# EasyEDA Pro project opendeep.dbg001.cnc.v01.eprj

# Schematic opendeep.dbg001.cnc.v01
Board Name: opendeep.dbg001.cnc.v01; Create Date: 2026-08-02; Page Name: P1; Project Name: opendeep.dbg001.cnc.v01; Schematic Name: opendeep.dbg001.cnc.v01; Update Date: 2026-08-02; Company: EasyEDA.com; Page Size: A4; Version: V1.0
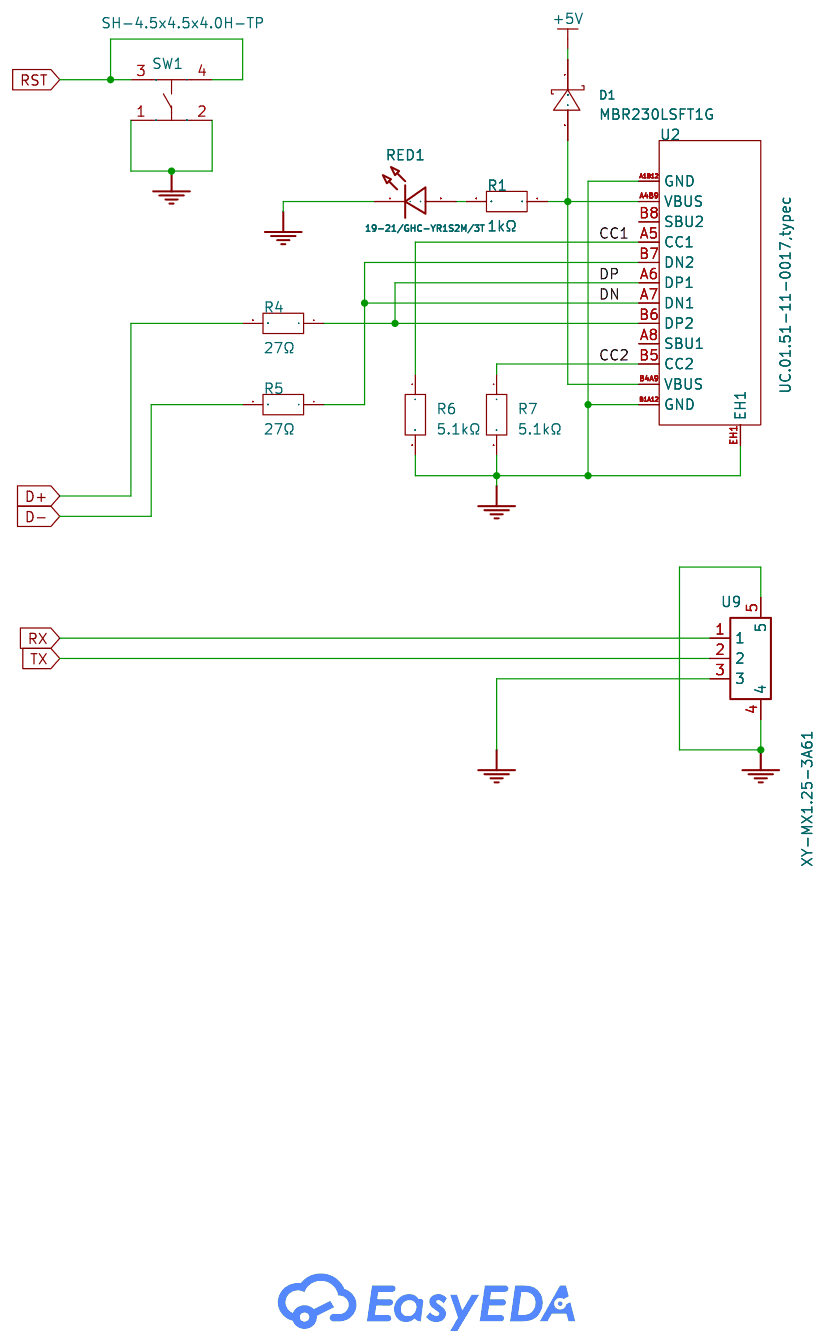
[diagram p0: schematic sheet]

## Parts
D1  MBR230LSFT1G  [SOD-123FL_L2.7-W1.8-LS3.8-RD]
R1  1kΩ  [R0603]
R4  27Ω  [R0603]
R5  27Ω  [R0603]
R6  5.1kΩ  [R0603]
R7  5.1kΩ  [R0603]
RED1  19-21/GHC-YR1S2M/3T  [LED-SMD_L1.6-W0.8-RD]
SW1  SH-4.5x4.5x4.0H-TP  [SW-SMD_4P-SH-4.5X4.5X4.0H-TP]
U2  UC.01.51-11-0017,typec  [TYPE-C-SMD_UC.01.51-11-0017]
U9  XY-MX1.25-3A61  [CONN-SMD_3P-P1.25_XY-MX1.25-3A61]

## Library data of the parts
D1 = MBR230LSFT1G: Voltage - Forward(Vf@If):430mV@2A Voltage - DC Reverse(Vr):30V Current - Rectified:2A Reverse Leakage Current (Ir):1mA@30V Operating Junction Temperature Range:-55℃~+125℃ Operating Junction Temperature Range:-55℃~+125℃ Non-Repetitive Peak Forward Surge Cu; LCSC Part Name: 电压:30V 电流:2A; Supplier Part: C126673; Manufacturer: onsemi(安森美); Supplier Footprint: SOD-123FL; JLCPCB Part Class: Extended Part; Datasheet: https://item.szlcsc.com/datasheet/MBR230LSFT1G/137953.html; Supplier: LCSC; Voltage - Forward(Vf@If): 430mV@2A; Voltage - DC Reverse(Vr): 30V; Current - Rectified: 2A; Reverse Leakage Current (Ir): 1mA@30V; Operating Junction Temperature Range: -55℃~+125℃; Non-Repetitive Peak Forward Surge Current: 40A
R1 R4-R7 = RCC06031K50FKEA: Type:Thick Film Resistor Resistance:1.5kΩ Tolerance:±1% Tolerance:±1% Power(Watts):200mW Temperature Coefficient:±100ppm/℃ Temperature Coefficient:±100ppm/℃ Operating Temperature:-55℃~+155℃ Operating Temperature:-55℃~+155℃; LCSC Part Name: 厚膜电阻 1.5kΩ ±1% 200mW; Supplier Part: C4303195; Manufacturer: VISHAY(威世); Supplier Footprint: 0603; JLCPCB Part Class: Extended Part; Datasheet: https://item.szlcsc.com/datasheet/RCC06031K50FKEA/4873636.html; Supplier: LCSC; Type: Thick Film Resistor; Tolerance: ±1%; Power(Watts): 200mW; Temperature Coefficient: ±100ppm/℃; Operating Temperature: -55℃~+155℃
RED1 = 19-21/GHC-YR1S2M/3T: Supplier: LCSC; Supplier Part: C605453; Manufacturer: EVERLIGHT(亿光); JLCPCB Part Class: Extended Part; Contributor: LCSC; spicePre: L
SW1 = SH-4.5x4.5x4.0H-TP: LCSC Part Name: TS4540TP 250gf编带; Supplier Part: C52092029; Manufacturer: SHOU HAN(首韩); Supplier Footprint: SMD; JLCPCB Part Class: Extended Part; Datasheet: https://item.szlcsc.com/datasheet/SH-4.5x4.5x4.0H-TP/54864053.html; Supplier: LCSC
U2 = UC.01.51-11-0017,typec: Supplier Part: C9900066641; Supplier Footprint: usb-c-smd_type-c-6pin; JLCPCB Part Class: Extended Part; Supplier: LCSC
U9 = XY-MX1.25-3A61: Supplier: LCSC; Supplier Part: C19272015; Manufacturer: XYECONN(辛译); Contributor: lcsc; spicePre: U

## Nets
+5V: D1.1(C)
GND: R6.2 R7.2 RED1.1(-) SW1.1 SW1.2 U2.A1B12(GND) U2.B1A12(GND) U2.EH1 U9.3 U9.4 U9.5
VBUS: D1.2(A) R1.1 U2.A4B9(VBUS) U2.B4A9(VBUS)
CC1: R6.1 U2.A5(CC1)
CC2: R7.1 U2.B5(CC2)
D+: R4.2
D-: R5.2
DN: R5.1 U2.A7(DN1) U2.B7(DN2)
DP: R4.1 U2.A6(DP1) U2.B6(DP2)
RST: SW1.3 SW1.4
RX: U9.1
TX: U9.2
$1N984: R1.2 RED1.2(+)

Not connected (* = marked no-connect by the designer): U2 A8(SBU1) B8(SBU2)

# Board opendeep.dbg001.cnc.v01
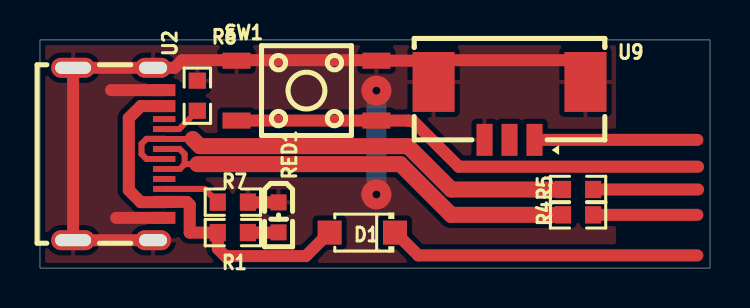
[diagram p1: board, top side]
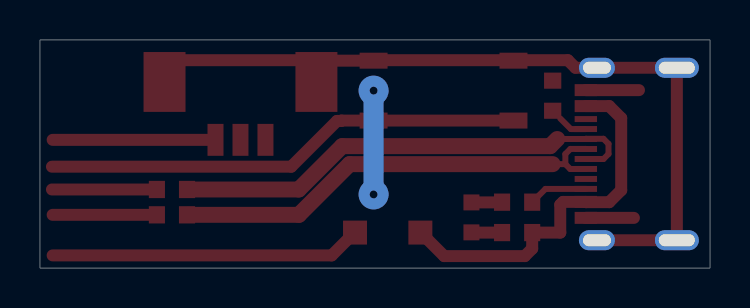
[diagram p2: board, bottom side, seen from below]

Outline 33.53 x 11.43 mm; copper layers: Top Layer, Bottom Layer. Coordinates in mm from the lower left corner of the outline.
Outline path: rectangle 0,11.43 33.53,0
Stack: Top Layer 0.035mm / Dielectric1 1.51mm FR4 er 4.5 / Bottom Layer 0.035mm

## Design rules (mm)
template: JLCPCB Capability(Two Layers Board)
spacing copperThickness1oz (default): track to track 0.102, other pairs 0.152 to 0.3
spacing copperThickness2oz: track to track 0.203, other pairs 0.152 to 0.3
track width copperThickness1oz (default): min 0.127, default 0.254, max 2.54
track width copperThickness2oz: min 0.203, default 0.254, max 2.54
differential pair differentialPair (default): width min 0.127, default 0.254, max 2.54; gap min 0.152, default 0.152
via viaSize (default): diameter min 0.5, default 0.61, max 10; hole min 0.3, default 0.305, max 6.3

## Placement (name value [footprint] x y rotation side)
D1  MBR230LSFT1G  [SOD-123FL_L2.7-W1.8-LS3.8-RD]  16.13 1.78 180 top
R1  1kΩ  [R0603]  9.65 1.78 0 top
R4  27Ω  [R0603]  26.92 2.67 0 top
R5  27Ω  [R0603]  26.92 3.94 0 top
R6  5.1kΩ  [R0603]  7.87 8.64 90 top
R7  5.1kΩ  [R0603]  9.65 3.3 0 top
RED1  19-21/GHC-YR1S2M/3T  [LED-SMD_L1.6-W0.8-RD]  11.94 2.54 270 top
SW1  SH-4.5x4.5x4.0H-TP  [SW-SMD_4P-SH-4.5X4.5X4.0H-TP]  13.34 8.89 0 top
U2  UC.01.51-11-0017,typec  [TYPE-C-SMD_UC.01.51-11-0017]  3.94 5.72 270 top
U9  XY-MX1.25-3A61  [CONN-SMD_3P-P1.25_XY-MX1.25-3A61]  23.5 7.87 180 top

## Footprints (pads in the part's own frame, mm; a bottom-side part is the same pattern mirrored in y, then rotated)
CONN-SMD_3P-P1.25_XY-MX1.25-3A61
  rect 0.8x1.6 smd: 1(-1.25,1.45) 2(0,1.45) 3(1.25,1.45)
  rect 2.1x3 smd: 4(3.8,-1.45) 5(-3.8,-1.45)
LED-SMD_L1.6-W0.8-RD
  rect 0.8x0.8 smd: 1(-0.75,0) 2(0.75,0)
R0603
  rect 0.806x0.864 smd: 1(-0.753,0) 2(0.753,0)
SOD-123FL_L2.7-W1.8-LS3.8-RD
  rect 1.2x1.2 smd: 1(-1.635,0) 2(1.635,0)
SW-SMD_4P-SH-4.5X4.5X4.0H-TP
  rect 1.4x0.8 smd: 1(-3.5,1.5) 2(3.5,1.5) 3(-3.5,-1.5) 4(3.5,-1.5)
TYPE-C-SMD_UC.01.51-11-0017
  rect 0.6x1.12 smd: A1B12(-3.2,2.277) A4B9(-2.4,2.277) B1A12(3.2,2.277) B4A9(2.4,2.277)
  rect 0.3x1.12 smd: A5(-1.25,2.277) A6(-0.25,2.277) A7(0.25,2.277) A8(1.25,2.277) B5(1.75,2.277) B6(0.75,2.277) B7(-0.75,2.277) B8(-1.75,2.277)
  oval 1x1.8 hole 0.6x1.4: EH1(-4.32,1.722) EH1(4.32,1.722)
  oval 1x2.2 hole 0.6x1.8: EH1(-4.32,-2.277) EH1(4.32,-2.277)

## Nets
As in the schematic.

Pads without a net: U2 A8 B8

## Via types
v1: diameter 1.5, hole 0.4, Top Layer to Bottom Layer, 2 vias

## Routing (per net, layer and track width the routed paths; a pad name or vN(x,y) marks a point on that pad's centre or on a via; arc(x,y) is an arc through that point)
+5V: length 15.6
  Top Layer w0.6: D1.1 17.79,1.78 18.93,0.64 32.89,0.64
GND: length 52.4
  Top Layer w0.6: 19.69,10.39 SW1.2 16.81,10.41 7.11,10.41 6.73,10.03 U2.EH1 U2.EH1 U2.EH1 U2.EH1 ; 19.69,10.39 U9.4 ; 19.69,10.39 19.69,10.41 27.29,10.41 U9.5 ; RED1.1 10.42,3.29 R7.2 ; U2.B1A12 3.81,2.52 ; U2.A1B12 3.56,8.92
  Bottom Layer w1: v1(16.84,8.89) v1(16.84,3.69)
VBUS: length 18.8
  Top Layer w0.6: 14.48,1.78 13.3,0.6 9.27,0.6 8.9,0.97 R1.1 7.49,1.78 7.49,3.17 7.35,3.31 U2.B4A9 6.2,3.3 5.04,3.3 4.44,3.9 4.44,7.52 5.04,8.12 U2.A4B9
CC1: length 1.5
  Top Layer w0.3: U2.A5 6.97,6.97 7.49,7.49
CC2: length 3
  Top Layer w0.3: U2.B5 8.24,3.97 R7.1
D+: length 5.2
  Top Layer w0.6: R4.2 32.89,2.67
D-: length 5.3
  Top Layer w0.6: R5.2 32.93,3.94
DN: length 24
  Top Layer w0.3: U2.A7 5.33,5.47 5.08,5.72 5.08,6.22 5.33,6.48 6.2,6.48 U2.B7 7.64,6.47
  Top Layer w0.8: R5.1 20.58,3.94 18.41,6.11 8,6.11 7.64,6.47
DP: length 22.7
  Top Layer w0.3: U2.A6 6.22,5.97 6.98,5.97 7.24,5.72 7.24,5.21 ; 7.24,5.21 7.87,5.21 ; 7.24,5.21 7,4.97 U2.B6
  Top Layer w0.8: R4.1 20.57,2.67 18.03,5.21 7.87,5.21
RST: length 24
  Top Layer w0.6: 32.93,5.08 20.95,5.08 18.66,7.37 18.46,7.37 18.44,7.39 SW1.4 SW1.3
RX: length 8.1
  Top Layer w0.6: U9.1 32.89,6.42
$1N984: length 1.5
  Top Layer w0.6: R1.2 11.93,1.78 RED1.2

## Copper pours and planes (outline as drawn; the poured copper is in the pictures)
GND on Top Layer: -0.25,11.68 28.83,11.68 28.83,-0.38 -0.25,-0.38
